# Altium schematic sheet [01] Power Suppy.SchDoc: Power Supply
size A4
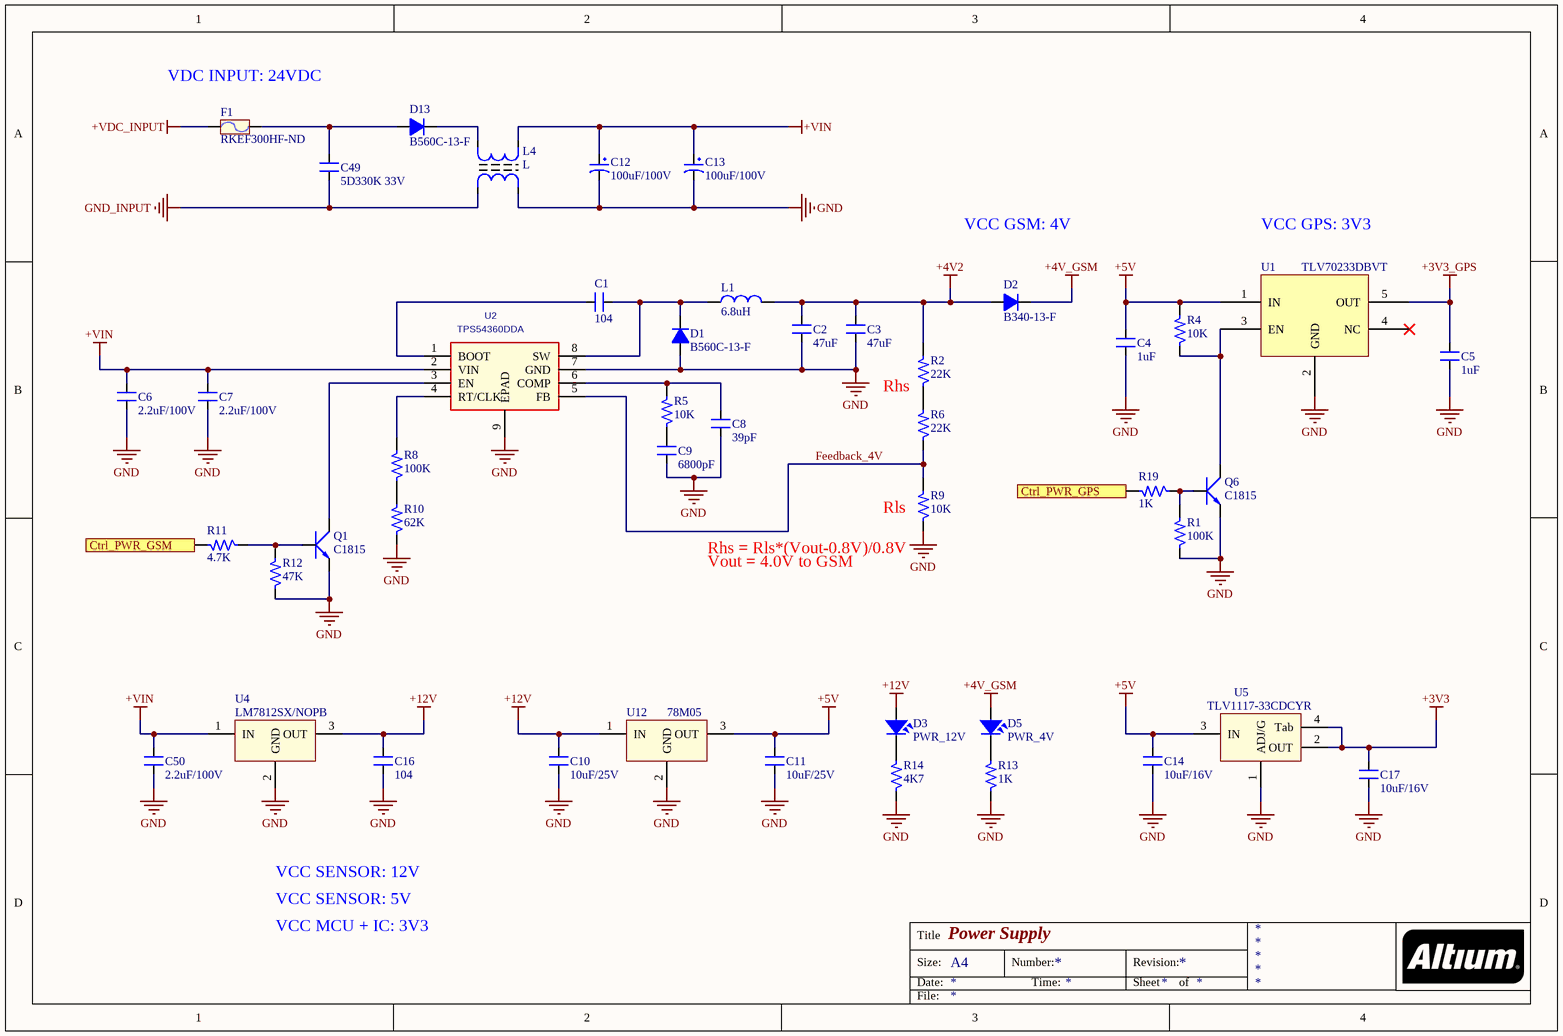
[diagram p0: [01] Power Suppy.SchDoc]

## Parts
C1  104  [C0603 SMT]
C2  47uF  [SM-1210]
C3  47uF  [SM-1210]
C4  1uF  [C0603 SMT]
C5  1uF  [C0603 SMT]
C6  2.2uF/100V  [SM-1210]
C7  2.2uF/100V  [SM-1210]
C8  39pF  [C0603 SMT]
C9  6800pF  [C0603 SMT]
C10  10uF/25V  [C0603 SMT]
C11  10uF/25V  [C0603 SMT]
C12  100uF/100V  [CP1.5/3.4]
C13  100uF/100V  [CP1.5/3.4]
C14  10uF/16V  [C0603 SMT]
C16  104  [C0603 SMT]
C17  10uF/16V  [C0603 SMT]
C49  5D330K 33V  [CN2]
C50  2.2uF/100V  [SM-1210]
D1  B560C-13-F  [DO-214AB SMC]
D2  B340-13-F  [DO-214AB SMA]
D3  PWR_12V  [Led_0603_Yellow]
D5  PWR_4V  [Led_0603_Green]
D13  B560C-13-F  [DO-214AB SMC]
F1  RKEF300HF-ND  [FUSE2]
L1  6.8uH  [L01 SMD 12*12*6]
L4  L  [L2 UF9.8]
Q1  C1815  [SOT23B]
Q6  C1815  [SOT23B]
R1  100K  [R0603 -SMT]
R2  22K  [R0603 -SMT]
R4  10K  [R0603 -SMT]
R5  10K  [R0603 -SMT]
R6  22K  [R0603 -SMT]
R8  100K  [R0603 -SMT]
R9  10K  [R0603 -SMT]
R10  62K  [R0603 -SMT]
R11  4.7K  [R0603 -SMT]
R12  47K  [R0603 -SMT]
R13  1K  [R0603 -SMT]
R14  4K7  [R0603 -SMT]
R19  1K  [R0603 -SMT]
U1  TLV70233DBVT  [TLV70233_3.3V]
U2  TPS54360DDA  [DDA8_3P1X2P4-M]
U4  LM7812SX/NOPB  [TO-263-4]
U5  TLV1117-33CDCYR  [SOT223-4N]
U12  78M05  [TO252-3L]

## Ports
Ctrl_PWR_GPS, Ctrl_PWR_GSM

## Nets
+3V3: C17.2 U5.2(OUT) U5.4(Tab)
+3V3_GPS: C5.2 U1.5(OUT)
+4V2: C2.2 C3.2 D2.1(A) L1.2 R2.2
+4V_GSM: D2.2(K) D5.1
+5V: C4.2 C11.2 C14.2 R4.2 U1.1(IN) U5.3(IN) U12.3(OUT)
+12V: C10.2 C16.2 D3.1 U4.3(OUT) U12.1(IN)
+VDC_INPUT: F1.1
+VIN: C6.2 C7.2 C12.1 C13.1 C50.2 L4.3 U2.2(VIN) U4.1(IN)
GND: C2.1 C3.1 C4.1 C5.1 C6.1 C7.1 C8.1 C9.1 C10.1 C11.1 C12.2 C13.2 C14.1 C16.1 C17.1 C50.1 D1.1(A) L4.2 Q1.1(E) Q6.1(E) R1.1 R9.1 R10.1 R12.1 R13.1 R14.1 U1.2(GND) U2.7(GND) U2.9(EPAD) U4.2(GND) U5.1(ADJ/G) U12.2(GND)
GND_INPUT: C49.1 L4.1
Ctrl_PWR_GPS: R19.2 ; port Ctrl_PWR_GPS
Ctrl_PWR_GSM: R11.2 ; port Ctrl_PWR_GSM
Feedback_4V: R6.1 R9.2 U2.5(FB)
NetC1_1: C1.1 U2.1(BOOT)
NetC1_2: C1.2 D1.2(K) L1.1 U2.8(SW)
NetC8_2: C8.2 R5.2 U2.6(COMP)
NetC9_2: C9.2 R5.1
NetC49_2: C49.2 D13.1(A) F1.2
NetD3_2: D3.2 R14.2
NetD5_2: D5.2 R13.2
NetD13_2: D13.2(K) L4.4
NetQ1_2: Q1.2(C) U2.3(EN)
NetQ1_3: Q1.3(B) R11.1 R12.2
NetQ6_2: Q6.2(C) R4.1 U1.3(EN)
NetQ6_3: Q6.3(B) R1.2 R19.1
NetR2_1: R2.1 R6.2
NetR8_1: R8.1 R10.2
NetR8_2: R8.2 U2.4(RT/CLK)

Not connected (* = marked no-connect by the designer): U1 4(NC)*

## Notes on the sheet
- (near F1) VDC INPUT: 24VDC
- VCC GSM: 4V
- VCC GPS: 3V3
- Rhs
- (near R9) Rls
- (near R9) Rhs = Rls*(Vout-0.8V)/0.8V
- Vout = 4.0V to GSM
- VCC SENSOR: 12V
- VCC SENSOR: 5V
- VCC MCU + IC: 3V3
- Title
- Size:
- Date:
- A4
- Number:
- Time:
- Revision:
- Sheet
- of
- File:

## Library data of the parts
C1 C4 C5 C8-C11 C14 C16 C17 = CM: Cap SMD; Value: 103
C2 = CM: CAP CER 47UF 10V X5R 1210; Value: 103
C3 = CM: CAP CER 47UF 10V X5R 1210 1276-3380-2-ND; Value: 103
C6 C7 C50 = CM: CAP CER 2.2UF 100V X7R 1210  445-4498-2-ND; Value: 103
C12 C13 = CP4: Cap 1000uF/16V - 220uF/50V; Description 5: 4,7uF>10uF/250V_3,3uF>10uF/400V - 2,2uF>4,7uF/450V; Description 1: 2200uF-3300uF/6,3V - 1000uF-2200uF/10V; Description 2: 1000uF/16V - 470uF => 1000uF/25V - 100uF/100V; Description 3: 330uF>470uF/35V_220uF>470uF/50V_10uF>22uF/250V; Description 4: 220uF => 330uF/63V - 10uF =>33uF/160 - 200V; Value: 1000uF/16V
C49 = CN: Value: 0,1uF/300V; Designed by: VanDungEvn
D1 D13 = D5A: DIODE SCHOTTKY 60V 5A SMC; Value: 1N5408
D2 = D1A: DIODE SCHOTTKY 40V 3A SMC; Value: 1N4007
D3 D5 = LED: LED Single colour Green and Red; Value: LED 3 ly Single Colour
F1 = Fuse: PTC RESET FUSE 60V 3A RADIAL; Designed by: VanDungEvn; Value: Fuse
L1 = L1: FIXED IND 6.2UH 5.7A 22.4 MOHM; Value: 150 mH
L4 = L2x220: Inductor; Value: Loc 220; Designed by: VanDungEvn
Q1 Q6 = C1815: NPN 600mW, ECB; Value: C1815
R1 R2 R4-R6 R8-R12 R14 = RM: Resistor SMD; Value: 1K
R13 R19 = RM: Resistor SMD; Value: 1K
U1 = TLV70233_3.3V
U2 = TPS54360DDA: REG BUCK SPLIT RAIL 8SOPWRPAD; C: Copyright (C) 2015 Accelerated Designs. All rights reserved; Vendor: TEXAS INSTRUMENTS; Built_By: EMA_UL_Team; Value: TPS54360DDA; Manufacturer_Part_Number: TPS54360DDA
U4 = LM78xx: Value: LM7805
U5 = LM1117: 3v3; Value: LM317
U12 = LM78xx: On ap +, from + 5 to + 24VDC; Value: LM7805